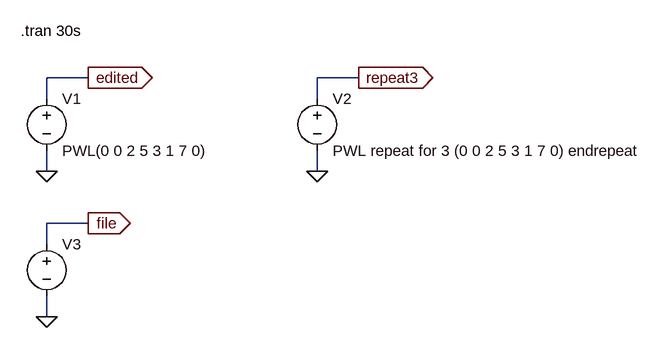
[diagram p0: schematic 08_PWL.asc]
08_PWL.asc, the LTspice schematic file:
Version 4
SHEET 1 984 680
WIRE 112 144 48 144
WIRE 528 144 464 144
WIRE 48 176 48 144
WIRE 464 176 464 144
WIRE 48 288 48 256
WIRE 464 288 464 256
WIRE 112 368 48 368
WIRE 48 400 48 368
WIRE 48 512 48 480
FLAG 48 288 0
FLAG 112 144 edited
IOPIN 112 144 Out
FLAG 464 288 0
FLAG 528 144 repeat3
IOPIN 528 144 Out
FLAG 48 512 0
FLAG 112 368 file
IOPIN 112 368 Out
SYMBOL Voltage 48 160 R0
SYMATTR InstName V1
SYMATTR Value PWL(0 0 2 5 3 1 7 0)
SYMBOL Voltage 464 160 R0
SYMATTR InstName V2
SYMATTR Value PWL repeat for 3 (0 0 2 5 3 1 7 0) endrepeat
SYMBOL Voltage 48 384 R0
SYMATTR InstName V3
SYMATTR Value ""
TEXT 8 72 Left 2 !.tran 30s

The netlist it stands for:
* 08_PWL.asc
V1 edited 0 PWL(0 0 2 5 3 1 7 0)
V2 repeat3 0 PWL repeat for 3 (0 0 2 5 3 1 7 0) endrepeat
V3 file 0
.tran 30s
.backanno
.end